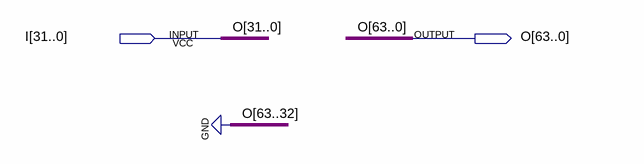
[diagram p0: schematic sheet]
// Quartus schematic SignExtend.bdf as structural Verilog: 0 symbols, 2 pins
module SignExtend (
  input  [31:0] I,
  output [63:0] O
);


  assign O = {{32{1'b0}}, I};
endmodule
